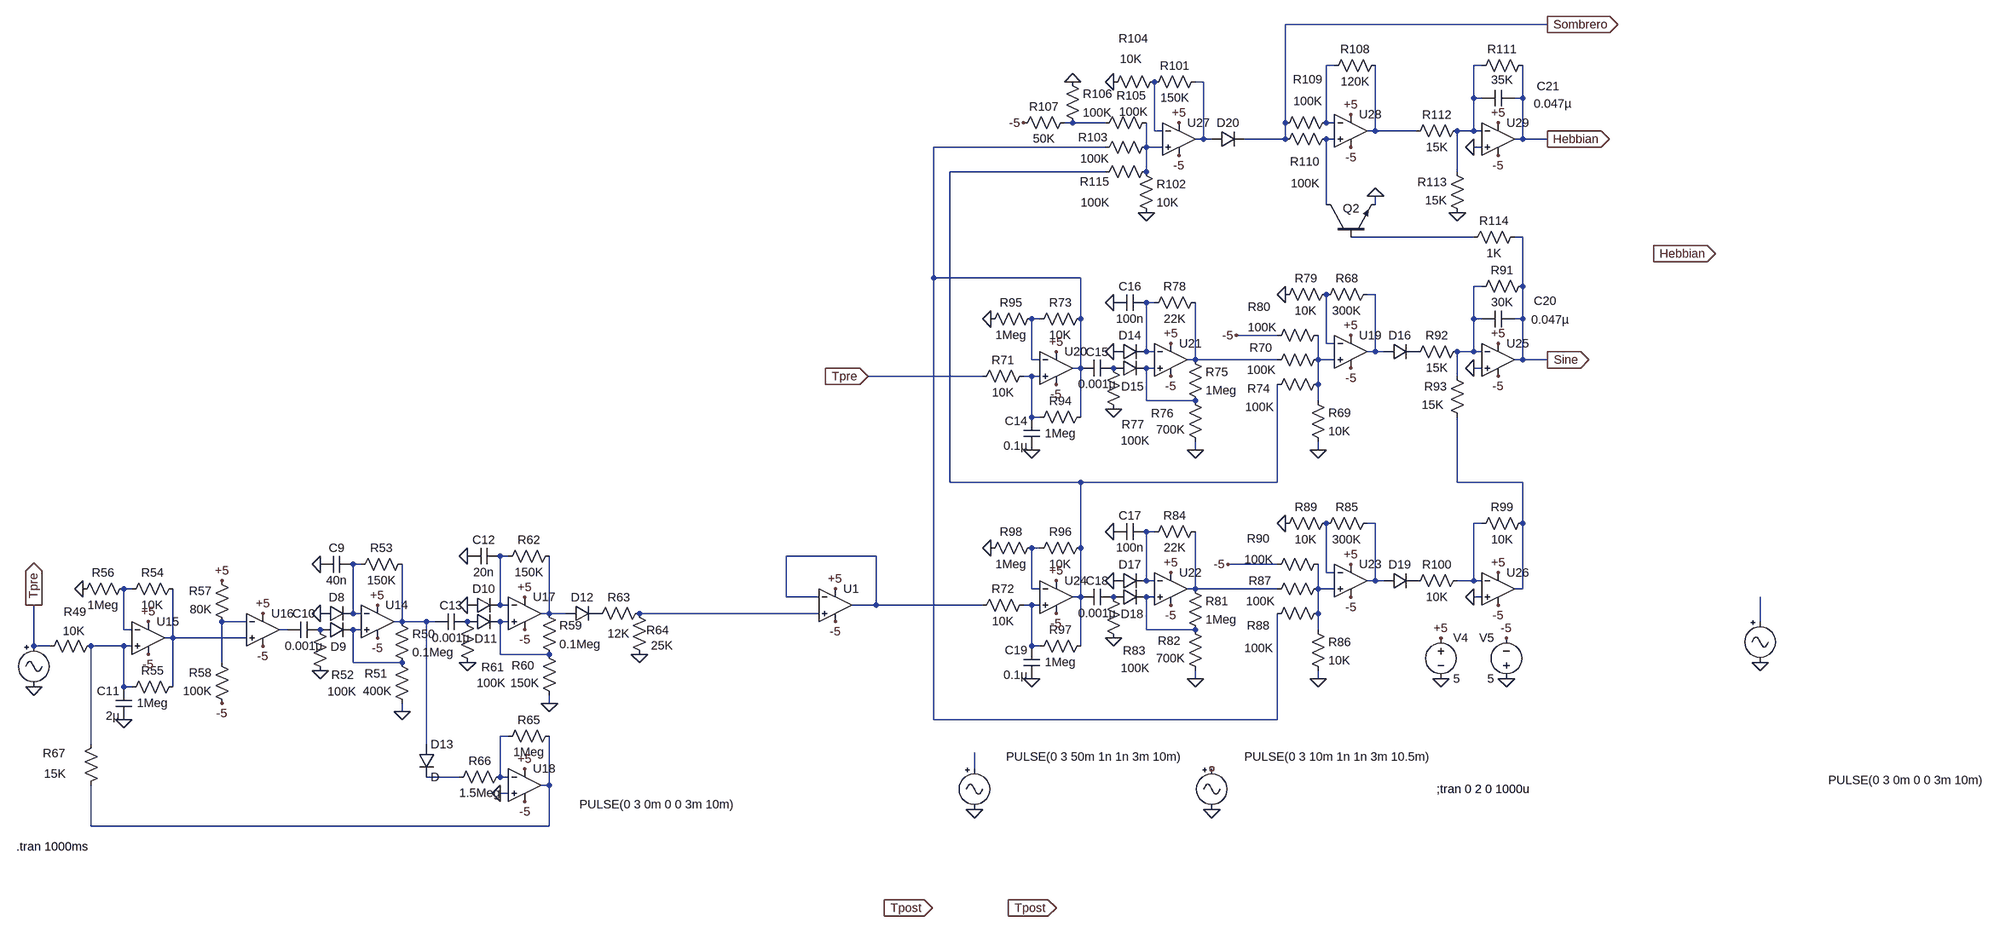
[diagram p0: schematic integrated_FB_leakage.asc]
integrated_FB_leakage.asc, the LTspice schematic file:
Version 4
SHEET 1 4420 1148
WIRE 2544 -704 2032 -704
WIRE 2128 -624 2112 -624
WIRE 2416 -624 2400 -624
WIRE 1872 -592 1856 -592
WIRE 2400 -560 2400 -624
WIRE 2416 -560 2400 -560
WIRE 2496 -560 2496 -624
WIRE 2496 -560 2480 -560
WIRE 1616 -512 1600 -512
WIRE 1680 -512 1616 -512
WIRE 2032 -512 2032 -704
WIRE 2112 -512 2112 -624
WIRE 2128 -512 2112 -512
WIRE 1776 -496 1776 -592
WIRE 1792 -496 1776 -496
WIRE 2208 -496 2208 -624
WIRE 2208 -496 2192 -496
WIRE 2288 -496 2208 -496
WIRE 2400 -496 2400 -560
WIRE 2400 -496 2368 -496
WIRE 2416 -496 2400 -496
WIRE 1872 -480 1872 -592
WIRE 1872 -480 1856 -480
WIRE 1888 -480 1872 -480
WIRE 2032 -480 2032 -512
WIRE 2032 -480 1952 -480
WIRE 2128 -480 2112 -480
WIRE 2496 -480 2496 -560
WIRE 2496 -480 2480 -480
WIRE 2544 -480 2496 -480
WIRE 1680 -464 1344 -464
WIRE 1760 -464 1760 -512
WIRE 1792 -464 1760 -464
WIRE 2416 -464 2400 -464
WIRE 1680 -416 1376 -416
WIRE 1760 -416 1760 -464
WIRE 2368 -416 2368 -496
WIRE 2112 -352 2112 -480
WIRE 2208 -352 2208 -368
WIRE 2400 -288 2160 -288
WIRE 2496 -288 2480 -288
WIRE 1344 -208 1344 -464
WIRE 1632 -208 1344 -208
WIRE 2416 -192 2400 -192
WIRE 2496 -192 2496 -288
WIRE 2208 -176 2192 -176
WIRE 1776 -160 1760 -160
WIRE 1552 -128 1536 -128
WIRE 1632 -128 1632 -208
WIRE 2400 -128 2400 -192
WIRE 2416 -128 2400 -128
WIRE 2496 -128 2496 -192
WIRE 2496 -128 2480 -128
WIRE 2016 -96 1936 -96
WIRE 2112 -80 2112 -176
WIRE 2128 -80 2112 -80
WIRE 1760 -64 1760 -160
WIRE 1776 -64 1760 -64
WIRE 2208 -64 2208 -176
WIRE 2208 -64 2192 -64
WIRE 2224 -64 2208 -64
WIRE 2400 -64 2400 -128
WIRE 2400 -64 2368 -64
WIRE 2416 -64 2400 -64
WIRE 1536 -48 1536 -128
WIRE 1552 -48 1536 -48
WIRE 1856 -48 1856 -160
WIRE 1856 -48 1840 -48
WIRE 2016 -48 1856 -48
WIRE 2096 -48 2096 -96
WIRE 2128 -48 2096 -48
WIRE 2496 -48 2496 -128
WIRE 2496 -48 2480 -48
WIRE 2544 -48 2496 -48
WIRE 1632 -32 1632 -128
WIRE 1632 -32 1616 -32
WIRE 1776 -32 1760 -32
WIRE 2416 -32 2400 -32
WIRE 1440 -16 1216 -16
WIRE 1536 -16 1520 -16
WIRE 1552 -16 1536 -16
WIRE 2368 -16 2368 -64
WIRE 2096 0 2096 -48
WIRE 1760 32 1760 -32
WIRE 1856 32 1760 32
WIRE 2096 32 2096 0
WIRE 1536 64 1536 -16
WIRE 1552 64 1536 64
WIRE 1632 64 1632 -32
WIRE 1856 128 1856 112
WIRE 2096 128 2096 112
WIRE 1376 192 1376 -416
WIRE 1632 192 1376 192
WIRE 2016 192 2016 0
WIRE 2016 192 1632 192
WIRE 2368 192 2368 64
WIRE 2496 192 2368 192
WIRE 2208 272 2192 272
WIRE 2416 272 2400 272
WIRE 2496 272 2496 192
WIRE 1776 288 1760 288
WIRE 1552 320 1536 320
WIRE 1632 320 1632 192
WIRE 448 336 432 336
WIRE 1232 336 1056 336
WIRE 160 352 144 352
WIRE 2016 352 1920 352
WIRE 2112 368 2112 272
WIRE 2128 368 2112 368
WIRE 1760 384 1760 288
WIRE 1776 384 1760 384
WIRE 2208 384 2208 272
WIRE 2208 384 2192 384
WIRE 2224 384 2208 384
WIRE 2400 384 2400 272
WIRE 2400 384 2368 384
WIRE 2416 384 2400 384
WIRE -288 400 -304 400
WIRE 1536 400 1536 320
WIRE 1552 400 1536 400
WIRE 1856 400 1856 288
WIRE 1856 400 1840 400
WIRE 2016 400 1856 400
WIRE 2096 400 2096 352
WIRE 2128 400 2096 400
WIRE 2496 400 2496 272
WIRE 2496 400 2480 400
WIRE 1056 416 1056 336
WIRE 1120 416 1056 416
WIRE 1632 416 1632 320
WIRE 1632 416 1616 416
WIRE 1776 416 1760 416
WIRE 2416 416 2400 416
WIRE 432 432 432 336
WIRE 448 432 432 432
WIRE 1232 432 1232 336
WIRE 1232 432 1184 432
WIRE 1440 432 1232 432
WIRE 1536 432 1520 432
WIRE 1552 432 1536 432
WIRE 144 448 144 352
WIRE 160 448 144 448
WIRE 528 448 528 336
WIRE 528 448 512 448
WIRE 560 448 528 448
WIRE 1120 448 704 448
WIRE 2096 448 2096 400
WIRE -64 464 -112 464
WIRE 240 464 240 352
WIRE 240 464 224 464
WIRE 288 464 240 464
WIRE 304 464 288 464
WIRE 448 464 432 464
WIRE 2960 464 2960 416
WIRE -304 480 -304 400
WIRE -288 480 -304 480
WIRE 16 480 0 480
WIRE 160 480 144 480
WIRE 1760 480 1760 416
WIRE 1856 480 1760 480
WIRE 2096 480 2096 448
WIRE -208 496 -208 400
WIRE -208 496 -224 496
WIRE -64 496 -208 496
WIRE -480 512 -480 432
WIRE -448 512 -480 512
WIRE -304 512 -368 512
WIRE -288 512 -304 512
WIRE 1536 512 1536 432
WIRE 1552 512 1536 512
WIRE 1632 512 1632 416
WIRE 432 528 432 464
WIRE 528 528 432 528
WIRE -112 544 -112 464
WIRE 144 544 144 480
WIRE 240 544 144 544
WIRE 1856 576 1856 560
WIRE 2096 576 2096 560
WIRE -304 592 -304 512
WIRE -288 592 -304 592
WIRE -208 592 -208 496
WIRE 528 624 528 608
WIRE 240 640 240 624
WIRE 1344 656 1344 -208
WIRE 2016 656 2016 448
WIRE 2016 656 1344 656
WIRE 448 688 432 688
WIRE -368 704 -368 512
WIRE 288 704 288 464
WIRE 1424 752 1424 720
WIRE 352 768 288 768
WIRE 432 768 432 688
WIRE 448 768 432 768
WIRE 528 784 528 688
WIRE 528 784 512 784
WIRE 448 800 432 800
WIRE -368 864 -368 784
WIRE 528 864 528 784
WIRE 528 864 -368 864
FLAG -480 592 0
FLAG 192 432 +5
FLAG 192 496 -5
FLAG 80 448 0
FLAG 80 352 0
FLAG 80 560 0
FLAG 240 640 0
FLAG -256 464 +5
FLAG -256 528 -5
FLAG -304 656 0
FLAG -384 400 0
FLAG -32 448 +5
FLAG -32 512 -5
FLAG -112 624 -5
FLAG -112 384 +5
FLAG 480 416 +5
FLAG 480 480 -5
FLAG 368 432 0
FLAG 368 336 0
FLAG 368 544 0
FLAG 528 624 0
FLAG 704 528 0
FLAG 480 752 +5
FLAG 480 816 -5
FLAG 432 800 0
FLAG 2160 -96 +5
FLAG 2160 -32 -5
FLAG 1888 832 0
FLAG 1424 832 0
FLAG 1584 -64 +5
FLAG 1584 0 -5
FLAG 1808 -80 +5
FLAG 1808 -16 -5
FLAG 1696 -64 0
FLAG 1696 -160 0
FLAG 1696 48 0
FLAG 2032 -176 0
FLAG 1936 -96 -5
FLAG 1808 368 +5
FLAG 1808 432 -5
FLAG 1696 384 0
FLAG 1696 288 0
FLAG 1696 496 0
FLAG 1856 576 0
FLAG 1856 128 0
FLAG 2160 352 +5
FLAG 2160 416 -5
FLAG 2032 272 0
FLAG 1920 352 -5
FLAG 1536 128 0
FLAG 1456 -128 0
FLAG 1584 384 +5
FLAG 1584 448 -5
FLAG 1536 576 0
FLAG 1456 320 0
FLAG 2448 -80 +5
FLAG 2448 -16 -5
FLAG 2448 368 +5
FLAG 2448 432 -5
FLAG 2400 416 0
FLAG 2400 -32 0
FLAG 2096 128 0
FLAG 2096 576 0
FLAG 2544 -48 Sine
IOPIN 2544 -48 Out
FLAG 1824 -512 +5
FLAG 1824 -448 -5
FLAG 1696 -592 0
FLAG 1616 -592 0
FLAG 2160 -528 +5
FLAG 2160 -464 -5
FLAG 1520 -512 -5
FLAG 2448 -512 +5
FLAG 2448 -448 -5
FLAG 2400 -464 0
FLAG 2368 -336 0
FLAG 2208 -368 0
FLAG 2544 -480 Hebbian
IOPIN 2544 -480 Out
FLAG 2544 -704 Sombrero
IOPIN 2544 -704 Out
FLAG 2336 576 0
FLAG 2464 576 0
FLAG 2464 496 -5
FLAG 2336 496 +5
FLAG 1584 1024 Tpost
IOPIN 1584 1024 In
FLAG 1248 1024 Tpost
IOPIN 1248 1024 Out
FLAG 1216 -16 Tpre
IOPIN 1216 -16 In
FLAG -480 432 Tpre
IOPIN -480 432 Out
FLAG 1760 -336 0
FLAG 2752 -256 Hebbian
IOPIN 2752 -256 Out
FLAG 1152 400 +5
FLAG 1152 464 -5
FLAG 2960 544 0
SYMBOL res -352 496 R90
WINDOW 0 -35 47 VBottom 2
WINDOW 3 -29 50 VTop 2
SYMATTR InstName R49
SYMATTR Value 10K
SYMBOL Opamps\\UniversalOpamp2 192 464 R0
SYMATTR InstName U14
SYMBOL diode 80 464 R270
WINDOW 0 32 32 VTop 2
WINDOW 3 0 32 Invisible 2
SYMATTR InstName D8
SYMBOL diode 80 496 R270
WINDOW 0 -33 36 VTop 2
WINDOW 3 0 32 Invisible 2
SYMATTR InstName D9
SYMBOL res 224 448 R0
SYMATTR InstName R50
SYMATTR Value 0.1Meg
SYMBOL res 256 640 R180
WINDOW 0 45 74 Left 2
WINDOW 3 36 40 Left 2
SYMATTR InstName R51
SYMATTR Value 400K
SYMBOL res 64 464 R0
WINDOW 0 38 104 Left 2
WINDOW 3 30 137 Left 2
SYMATTR InstName R52
SYMATTR Value 100K
SYMBOL res 256 336 R90
WINDOW 0 0 56 VBottom 2
WINDOW 3 32 56 VTop 2
SYMATTR InstName R53
SYMATTR Value 150K
SYMBOL cap 144 336 R90
WINDOW 0 0 32 VBottom 2
WINDOW 3 32 32 VTop 2
SYMATTR InstName C9
SYMATTR Value 40n
SYMBOL cap 80 464 R90
WINDOW 0 0 32 VBottom 2
WINDOW 3 32 32 VTop 2
SYMATTR InstName C10
SYMATTR Value 0.001µ
SYMBOL Opamps\\UniversalOpamp2 -256 496 R0
SYMATTR InstName U15
SYMBOL cap -288 656 R180
WINDOW 0 24 56 Left 2
WINDOW 3 24 8 Left 2
SYMATTR InstName C11
SYMATTR Value 2µ
SYMBOL res -192 384 R90
WINDOW 0 0 56 VBottom 2
WINDOW 3 32 56 VTop 2
SYMATTR InstName R54
SYMATTR Value 10K
SYMBOL res -192 576 R90
WINDOW 0 0 56 VBottom 2
WINDOW 3 32 56 VTop 2
SYMATTR InstName R55
SYMATTR Value 1Meg
SYMBOL res -400 416 R270
WINDOW 0 32 56 VTop 2
WINDOW 3 0 56 VBottom 2
SYMATTR InstName R56
SYMATTR Value 1Meg
SYMBOL Misc\\signal -480 496 R0
WINDOW 0 24 16 Invisible 2
WINDOW 3 1067 326 Left 2
WINDOW 123 0 0 Left 2
WINDOW 39 0 0 Left 2
SYMATTR InstName V7
SYMATTR Value PULSE(0 3 0m 0 0 3m 10m)
SYMBOL Opamps\\UniversalOpamp2 -32 480 R0
SYMATTR InstName U16
SYMBOL res -96 480 R180
WINDOW 0 36 76 Left 2
WINDOW 3 36 40 Left 2
SYMATTR InstName R57
SYMATTR Value 80K
SYMBOL res -96 640 R180
WINDOW 0 36 76 Left 2
WINDOW 3 36 40 Left 2
SYMATTR InstName R58
SYMATTR Value 100K
SYMBOL Opamps\\UniversalOpamp2 480 448 R0
SYMATTR InstName U17
SYMBOL diode 368 448 R270
WINDOW 0 32 32 VTop 2
WINDOW 3 0 32 Invisible 2
SYMATTR InstName D10
SYMBOL diode 368 480 R270
WINDOW 0 -33 36 VTop 2
WINDOW 3 0 32 Invisible 2
SYMATTR InstName D11
SYMBOL res 512 432 R0
SYMATTR InstName R59
SYMATTR Value 0.1Meg
SYMBOL res 544 624 R180
WINDOW 0 45 74 Left 2
WINDOW 3 36 40 Left 2
SYMATTR InstName R60
SYMATTR Value 150K
SYMBOL res 352 448 R0
WINDOW 0 43 105 Left 2
WINDOW 3 34 136 Left 2
SYMATTR InstName R61
SYMATTR Value 100K
SYMBOL res 544 320 R90
WINDOW 0 0 56 VBottom 2
WINDOW 3 32 56 VTop 2
SYMATTR InstName R62
SYMATTR Value 150K
SYMBOL cap 432 320 R90
WINDOW 0 0 32 VBottom 2
WINDOW 3 32 32 VTop 2
SYMATTR InstName C12
SYMATTR Value 20n
SYMBOL cap 368 448 R90
WINDOW 0 0 32 VBottom 2
WINDOW 3 32 32 VTop 2
SYMATTR InstName C13
SYMATTR Value 0.001µ
SYMBOL diode 560 464 R270
WINDOW 0 32 32 VTop 2
WINDOW 3 0 32 Invisible 2
SYMATTR InstName D12
SYMBOL res 720 432 R90
WINDOW 0 0 56 VBottom 2
WINDOW 3 40 57 VTop 2
SYMATTR InstName R63
SYMATTR Value 12K
SYMBOL res 720 544 R180
WINDOW 0 -42 63 Left 2
WINDOW 3 -50 33 Left 2
SYMATTR InstName R64
SYMATTR Value 25K
SYMBOL Opamps\\UniversalOpamp2 480 784 R0
SYMATTR InstName U18
SYMBOL res 544 672 R90
WINDOW 0 0 56 VBottom 2
WINDOW 3 32 56 VTop 2
SYMATTR InstName R65
SYMATTR Value 1Meg
SYMBOL res 336 784 R270
WINDOW 0 32 56 VTop 2
WINDOW 3 0 56 VBottom 2
SYMATTR InstName R66
SYMATTR Value 1.5Meg
SYMBOL diode 272 704 R0
SYMATTR InstName D13
SYMBOL res -352 688 M0
WINDOW 0 66 34 Left 2
WINDOW 3 65 74 Left 2
SYMATTR InstName R67
SYMATTR Value 15K
SYMBOL Opamps\\UniversalOpamp2 2160 -64 R0
SYMATTR InstName U19
SYMBOL res 2208 -192 R90
WINDOW 0 0 56 VBottom 2
WINDOW 3 32 56 VTop 2
SYMATTR InstName R68
SYMATTR Value 300K
SYMBOL res 2080 16 R0
SYMATTR InstName R69
SYMATTR Value 10K
SYMBOL res 2112 -64 R90
WINDOW 0 8 128 VBottom 2
WINDOW 3 20 127 VTop 2
SYMATTR InstName R70
SYMATTR Value 100K
SYMBOL Opamps\\UniversalOpamp2 1584 -32 R0
SYMATTR InstName U20
SYMBOL cap 1552 128 R180
WINDOW 0 24 56 Left 2
WINDOW 3 24 8 Left 2
SYMATTR InstName C14
SYMATTR Value 0.1µ
SYMBOL res 1536 -32 R90
WINDOW 0 0 56 VBottom 2
WINDOW 3 32 56 VTop 2
SYMATTR InstName R71
SYMATTR Value 10K
SYMBOL res 1536 416 R90
WINDOW 0 0 56 VBottom 2
WINDOW 3 32 56 VTop 2
SYMATTR InstName R72
SYMATTR Value 10K
SYMBOL res 1648 -144 R90
WINDOW 0 0 56 VBottom 2
WINDOW 3 32 56 VTop 2
SYMATTR InstName R73
SYMATTR Value 10K
SYMBOL res 2112 -16 R90
WINDOW 0 40 132 VBottom 2
WINDOW 3 45 130 VTop 2
SYMATTR InstName R74
SYMATTR Value 100K
SYMBOL Opamps\\UniversalOpamp2 1808 -48 R0
SYMATTR InstName U21
SYMBOL diode 1696 -48 R270
WINDOW 0 32 32 VTop 2
WINDOW 3 0 32 Invisible 2
SYMATTR InstName D14
SYMBOL diode 1696 -16 R270
WINDOW 0 -36 37 VTop 2
WINDOW 3 0 32 Invisible 2
SYMATTR InstName D15
SYMBOL res 1840 -64 R0
SYMATTR InstName R75
SYMATTR Value 1Meg
SYMBOL res 1872 128 R180
WINDOW 0 58 71 Left 2
WINDOW 3 36 40 Left 2
SYMATTR InstName R76
SYMATTR Value 700K
SYMBOL res 1680 -48 R0
WINDOW 0 32 126 Left 2
WINDOW 3 30 158 Left 2
SYMATTR InstName R77
SYMATTR Value 100K
SYMBOL cap 1696 -48 R90
WINDOW 0 0 32 VBottom 2
WINDOW 3 32 32 VTop 2
SYMATTR InstName C15
SYMATTR Value 0.001µ
SYMBOL res 1872 -176 R90
WINDOW 0 0 56 VBottom 2
WINDOW 3 32 56 VTop 2
SYMATTR InstName R78
SYMATTR Value 22K
SYMBOL cap 1760 -176 R90
WINDOW 0 0 32 VBottom 2
WINDOW 3 32 32 VTop 2
SYMATTR InstName C16
SYMATTR Value 100n
SYMBOL res 2016 -160 R270
WINDOW 0 32 56 VTop 2
WINDOW 3 0 56 VBottom 2
SYMATTR InstName R79
SYMATTR Value 10K
SYMBOL diode 2224 -48 R270
WINDOW 0 32 32 VTop 2
WINDOW 3 0 32 Invisible 2
SYMATTR InstName D16
SYMBOL res 2112 -112 R90
WINDOW 0 -24 131 VBottom 2
WINDOW 3 -15 125 VTop 2
SYMATTR InstName R80
SYMATTR Value 100K
SYMBOL Opamps\\UniversalOpamp2 1808 400 R0
SYMATTR InstName U22
SYMBOL diode 1696 400 R270
WINDOW 0 32 32 VTop 2
WINDOW 3 0 32 Invisible 2
SYMATTR InstName D17
SYMBOL diode 1696 432 R270
WINDOW 0 -33 36 VTop 2
WINDOW 3 0 32 Invisible 2
SYMATTR InstName D18
SYMBOL res 1840 384 R0
SYMATTR InstName R81
SYMATTR Value 1Meg
SYMBOL res 1872 576 R180
WINDOW 0 45 74 Left 2
WINDOW 3 36 40 Left 2
SYMATTR InstName R82
SYMATTR Value 700K
SYMBOL res 1680 400 R0
WINDOW 0 34 121 Left 2
WINDOW 3 30 155 Left 2
SYMATTR InstName R83
SYMATTR Value 100K
SYMBOL res 1872 272 R90
WINDOW 0 0 56 VBottom 2
WINDOW 3 32 56 VTop 2
SYMATTR InstName R84
SYMATTR Value 22K
SYMBOL cap 1760 272 R90
WINDOW 0 0 32 VBottom 2
WINDOW 3 32 32 VTop 2
SYMATTR InstName C17
SYMATTR Value 100n
SYMBOL cap 1696 400 R90
WINDOW 0 0 32 VBottom 2
WINDOW 3 32 32 VTop 2
SYMATTR InstName C18
SYMATTR Value 0.001µ
SYMBOL Opamps\\UniversalOpamp2 2160 384 R0
SYMATTR InstName U23
SYMBOL res 2208 256 R90
WINDOW 0 0 56 VBottom 2
WINDOW 3 32 56 VTop 2
SYMATTR InstName R85
SYMATTR Value 300K
SYMBOL res 2080 464 R0
SYMATTR InstName R86
SYMATTR Value 10K
SYMBOL res 2112 384 R90
WINDOW 0 16 130 VBottom 2
WINDOW 3 25 129 VTop 2
SYMATTR InstName R87
SYMATTR Value 100K
SYMBOL res 2112 432 R90
WINDOW 0 55 133 VBottom 2
WINDOW 3 68 132 VTop 2
SYMATTR InstName R88
SYMATTR Value 100K
SYMBOL res 2016 288 R270
WINDOW 0 32 56 VTop 2
WINDOW 3 0 56 VBottom 2
SYMATTR InstName R89
SYMATTR Value 10K
SYMBOL diode 2224 400 R270
WINDOW 0 32 32 VTop 2
WINDOW 3 0 32 Invisible 2
SYMATTR InstName D19
SYMBOL res 2112 336 R90
WINDOW 0 -19 133 VBottom 2
WINDOW 3 -9 132 VTop 2
SYMATTR InstName R90
SYMATTR Value 100K
SYMBOL res 2512 -208 R90
WINDOW 0 0 56 VBottom 2
WINDOW 3 32 56 VTop 2
SYMATTR InstName R91
SYMATTR Value 30K
SYMBOL res 2384 -80 R90
WINDOW 0 0 56 VBottom 2
WINDOW 3 32 56 VTop 2
SYMATTR InstName R92
SYMATTR Value 15K
SYMBOL res 2384 80 R180
WINDOW 0 36 76 Left 2
WINDOW 3 43 40 Left 2
SYMATTR InstName R93
SYMATTR Value 15K
SYMBOL res 1648 48 R90
WINDOW 0 0 56 VBottom 2
WINDOW 3 32 56 VTop 2
SYMATTR InstName R94
SYMATTR Value 1Meg
SYMBOL res 1552 -144 R90
WINDOW 0 0 56 VBottom 2
WINDOW 3 32 56 VTop 2
SYMATTR InstName R95
SYMATTR Value 1Meg
SYMBOL Opamps\\UniversalOpamp2 1584 416 R0
SYMATTR InstName U24
SYMBOL cap 1552 576 R180
WINDOW 0 24 56 Left 2
WINDOW 3 24 8 Left 2
SYMATTR InstName C19
SYMATTR Value 0.1µ
SYMBOL res 1648 304 R90
WINDOW 0 0 56 VBottom 2
WINDOW 3 32 56 VTop 2
SYMATTR InstName R96
SYMATTR Value 10K
SYMBOL res 1648 496 R90
WINDOW 0 0 56 VBottom 2
WINDOW 3 32 56 VTop 2
SYMATTR InstName R97
SYMATTR Value 1Meg
SYMBOL res 1552 304 R90
WINDOW 0 0 56 VBottom 2
WINDOW 3 32 56 VTop 2
SYMATTR InstName R98
SYMATTR Value 1Meg
SYMBOL Opamps\\UniversalOpamp2 2448 -48 R0
SYMATTR InstName U25
SYMBOL res 2512 256 R90
WINDOW 0 0 56 VBottom 2
WINDOW 3 32 56 VTop 2
SYMATTR InstName R99
SYMATTR Value 10K
SYMBOL Opamps\\UniversalOpamp2 2448 400 R0
SYMATTR InstName U26
SYMBOL res 2384 368 R90
WINDOW 0 0 56 VBottom 2
WINDOW 3 32 56 VTop 2
SYMATTR InstName R100
SYMATTR Value 10K
SYMBOL cap 2480 -144 R90
WINDOW 0 -4 -60 VBottom 2
WINDOW 3 2 -70 VTop 2
SYMATTR InstName C20
SYMATTR Value 0.047µ
SYMBOL Opamps\\UniversalOpamp2 1824 -480 R0
SYMATTR InstName U27
SYMBOL res 1872 -608 R90
WINDOW 0 0 56 VBottom 2
WINDOW 3 32 56 VTop 2
SYMATTR InstName R101
SYMATTR Value 150K
SYMBOL res 1744 -432 R0
SYMATTR InstName R102
SYMATTR Value 10K
SYMBOL res 1776 -480 R90
WINDOW 0 12 120 VBottom 2
WINDOW 3 23 117 VTop 2
SYMATTR InstName R103
SYMATTR Value 100K
SYMBOL res 1680 -576 R270
WINDOW 0 85 55 VTop 2
WINDOW 3 76 50 VBottom 2
SYMATTR InstName R104
SYMATTR Value 10K
SYMBOL res 1776 -528 R90
WINDOW 0 -21 45 VBottom 2
WINDOW 3 -21 41 VTop 2
SYMATTR InstName R105
SYMATTR Value 100K
SYMBOL res 1600 -608 R0
SYMATTR InstName R106
SYMATTR Value 100K
SYMBOL res 1616 -528 R90
WINDOW 0 0 56 VBottom 2
WINDOW 3 32 56 VTop 2
SYMATTR InstName R107
SYMATTR Value 50K
SYMBOL diode 1888 -464 R270
WINDOW 0 32 32 VTop 2
WINDOW 3 0 32 Invisible 2
SYMATTR InstName D20
SYMBOL res 2224 -640 R90
WINDOW 0 0 56 VBottom 2
WINDOW 3 32 56 VTop 2
SYMATTR InstName R108
SYMATTR Value 120K
SYMBOL Opamps\\UniversalOpamp2 2160 -496 R0
SYMATTR InstName U28
SYMBOL res 2128 -528 R90
WINDOW 0 -53 52 VBottom 2
WINDOW 3 -42 52 VTop 2
SYMATTR InstName R109
SYMATTR Value 100K
SYMBOL res 2128 -496 R90
WINDOW 0 76 58 VBottom 2
WINDOW 3 87 57 VTop 2
SYMATTR InstName R110
SYMATTR Value 100K
SYMBOL npn 2112 -288 R270
WINDOW 0 56 32 VRight 2
WINDOW 3 56 68 Invisible 2
SYMATTR InstName Q2
SYMBOL res 2512 -640 R90
WINDOW 0 0 56 VBottom 2
WINDOW 3 60 56 VBottom 2
SYMATTR InstName R111
SYMATTR Value 35K
SYMBOL res 2384 -512 R90
WINDOW 0 0 56 VBottom 2
WINDOW 3 32 56 VTop 2
SYMATTR InstName R112
SYMATTR Value 15K
SYMBOL res 2384 -320 R180
WINDOW 0 36 76 Left 2
WINDOW 3 36 40 Left 2
SYMATTR InstName R113
SYMATTR Value 15K
SYMBOL Opamps\\UniversalOpamp2 2448 -480 R0
SYMATTR InstName U29
SYMBOL cap 2480 -576 R90
WINDOW 0 8 -66 VBottom 2
WINDOW 3 11 -75 VTop 2
SYMATTR InstName C21
SYMATTR Value 0.047µ
SYMBOL res 2384 -272 R270
WINDOW 0 32 56 VTop 2
WINDOW 3 0 56 VBottom 2
SYMATTR InstName R114
SYMATTR Value 1K
SYMBOL voltage 2336 480 R0
WINDOW 123 0 0 Left 2
WINDOW 39 0 0 Left 2
SYMATTR InstName V4
SYMATTR Value 5
SYMBOL voltage 2464 592 R180
WINDOW 0 24 96 Left 2
WINDOW 3 24 16 Left 2
WINDOW 123 0 0 Left 2
WINDOW 39 0 0 Left 2
SYMATTR InstName V5
SYMATTR Value 5
SYMBOL Misc\\signal 1424 736 R0
WINDOW 0 24 16 Invisible 2
WINDOW 3 62 -8 Left 2
WINDOW 123 0 0 Left 2
WINDOW 39 0 0 Left 2
SYMATTR InstName V6
SYMATTR Value PULSE(0 3 50m 1n 1n 3m 10m)
SYMBOL Misc\\signal 1888 736 R0
WINDOW 0 24 16 Invisible 2
WINDOW 3 64 -8 Left 2
WINDOW 123 0 0 Left 2
WINDOW 39 0 0 Left 2
SYMATTR InstName V8
SYMATTR Value PULSE(0 3 10m 1n 1n 3m 10.5m)
SYMBOL res 1776 -432 R90
WINDOW 0 51 117 VBottom 2
WINDOW 3 61 116 VTop 2
SYMATTR InstName R115
SYMATTR Value 100K
SYMBOL Opamps\\UniversalOpamp2 1152 432 R0
SYMATTR InstName U1
SYMBOL Misc\\signal 2960 448 R0
WINDOW 0 24 16 Invisible 2
WINDOW 3 1067 326 Left 2
WINDOW 123 0 0 Left 2
WINDOW 39 0 0 Left 2
SYMATTR InstName V1
SYMATTR Value PULSE(0 3 0m 0 0 3m 10m)
TEXT -514 904 Left 2 !.tran 1000ms
TEXT 2328 792 Left 2 !;tran 0 2 0 1000u

The netlist it stands for:
* integrated_FB_leakage.asc
R49 N044 Tpre 10K
XU14 N042 N028 +5 -5 N038 level.2 Avol=1Meg GBW=10Meg Slew=10Meg ilimit=25m rail=0 Vos=0 phimargin=45 en=0 enk=0 in=0 ink=0 Rin=500Meg  ; pins IN+ IN- V+ V- OUT
D8 0 N028 D
D9 P001 N042 D
R50 N038 N042 0.1Meg
R51 0 N042 400K
R52 P001 0 100K
R53 N038 N028 150K
C9 N028 0 40n
C10 P001 N041 0.001µ
XU15 N044 N030 +5 -5 N043 level.2 Avol=1Meg GBW=10Meg Slew=10Meg ilimit=25m rail=0 Vos=0 phimargin=45 en=0 enk=0 in=0 ink=0 Rin=500Meg  ; pins IN+ IN- V+ V- OUT
C11 0 N044 2µ
R54 N043 N030 10K
R55 N043 N044 1Meg
R56 0 N030 1Meg
V7 Tpre 0 PULSE(0 3 0m 0 0 3m 10m)
XU16 N043 N037 +5 -5 N041 level.2 Avol=1Meg GBW=10Meg Slew=10Meg ilimit=25m rail=0 Vos=0 phimargin=45 en=0 enk=0 in=0 ink=0 Rin=500Meg  ; pins IN+ IN- V+ V- OUT
R57 N037 +5 80K
R58 -5 N037 100K
XU17 N039 N026 +5 -5 N035 level.2 Avol=1Meg GBW=10Meg Slew=10Meg ilimit=25m rail=0 Vos=0 phimargin=45 en=0 enk=0 in=0 ink=0 Rin=500Meg  ; pins IN+ IN- V+ V- OUT
D10 0 N026 D
D11 P002 N039 D
R59 N035 N039 0.1Meg
R60 0 N039 150K
R61 P002 0 100K
R62 N035 N026 150K
C12 N026 0 20n
C13 P002 N038 0.001µ
D12 N035 P003 D
R63 N036 P003 12K
R64 0 N036 25K
XU18 0 N045 +5 -5 N048 level.2 Avol=1Meg GBW=10Meg Slew=10Meg ilimit=25m rail=0 Vos=0 phimargin=45 en=0 enk=0 in=0 ink=0 Rin=500Meg  ; pins IN+ IN- V+ V- OUT
R65 N048 N045 1Meg
R66 N047 N045 1.5Meg
D13 N038 N047 D
R67 N044 N048 15K
XU19 N018 N016 +5 -5 N013 level.2 Avol=1Meg GBW=10Meg Slew=10Meg ilimit=25m rail=0 Vos=0 phimargin=45 en=0 enk=0 in=0 ink=0 Rin=500Meg  ; pins IN+ IN- V+ V- OUT
R68 N013 N016 300K
R69 N018 0 10K
R70 N018 N017 100K
XU20 N020 N015 +5 -5 N008 level.2 Avol=1Meg GBW=10Meg Slew=10Meg ilimit=25m rail=0 Vos=0 phimargin=45 en=0 enk=0 in=0 ink=0 Rin=500Meg  ; pins IN+ IN- V+ V- OUT
C14 0 N020 0.1µ
R71 N020 Tpre 10K
R72 N034 N027 10K
R73 N008 N015 10K
R74 N018 N010 100K
XU21 N019 N014 +5 -5 N017 level.2 Avol=1Meg GBW=10Meg Slew=10Meg ilimit=25m rail=0 Vos=0 phimargin=45 en=0 enk=0 in=0 ink=0 Rin=500Meg  ; pins IN+ IN- V+ V- OUT
D14 0 N014 D
D15 P004 N019 D
R75 N017 N019 1Meg
R76 0 N019 700K
R77 P004 0 100K
C15 P004 N008 0.001µ
R78 N017 N014 22K
C16 N014 0 100n
R79 0 N016 10K
D16 N013 P005 D
R80 N018 -5 100K
XU22 N033 N024 +5 -5 N031 level.2 Avol=1Meg GBW=10Meg Slew=10Meg ilimit=25m rail=0 Vos=0 phimargin=45 en=0 enk=0 in=0 ink=0 Rin=500Meg  ; pins IN+ IN- V+ V- OUT
D17 0 N024 D
D18 P006 N033 D
R81 N031 N033 1Meg
R82 0 N033 700K
R83 P006 0 100K
R84 N031 N024 22K
C17 N024 0 100n
C18 P006 N010 0.001µ
XU23 N032 N029 +5 -5 N022 level.2 Avol=1Meg GBW=10Meg Slew=10Meg ilimit=25m rail=0 Vos=0 phimargin=45 en=0 enk=0 in=0 ink=0 Rin=500Meg  ; pins IN+ IN- V+ V- OUT
R85 N022 N029 300K
R86 N032 0 10K
R87 N032 N031 100K
R88 N032 N008 100K
R89 0 N029 10K
D19 N022 P007 D
R90 N032 -5 100K
R91 Sine N012 30K
R92 N012 P005 15K
R93 N021 N012 15K
R94 N008 N020 1Meg
R95 N015 0 1Meg
XU24 N034 N025 +5 -5 N010 level.2 Avol=1Meg GBW=10Meg Slew=10Meg ilimit=25m rail=0 Vos=0 phimargin=45 en=0 enk=0 in=0 ink=0 Rin=500Meg  ; pins IN+ IN- V+ V- OUT
C19 0 N034 0.1µ
R96 N010 N025 10K
R97 N010 N034 1Meg
R98 N025 0 1Meg
XU25 0 N012 +5 -5 Sine level.2 Avol=1Meg GBW=10Meg Slew=10Meg ilimit=25m rail=0 Vos=0 phimargin=45 en=0 enk=0 in=0 ink=0 Rin=500Meg  ; pins IN+ IN- V+ V- OUT
R99 N021 N023 10K
XU26 0 N023 +5 -5 N021 level.2 Avol=1Meg GBW=10Meg Slew=10Meg ilimit=25m rail=0 Vos=0 phimargin=45 en=0 enk=0 in=0 ink=0 Rin=500Meg  ; pins IN+ IN- V+ V- OUT
R100 N023 P007 10K
C20 Sine N012 0.047µ
XU27 N009 N005 +5 -5 N003 level.2 Avol=1Meg GBW=10Meg Slew=10Meg ilimit=25m rail=0 Vos=0 phimargin=45 en=0 enk=0 in=0 ink=0 Rin=500Meg  ; pins IN+ IN- V+ V- OUT
R101 N003 N005 150K
R102 N009 0 10K
R103 N009 N008 100K
R104 0 N005 10K
R105 N009 N004 100K
R106 0 N004 100K
R107 N004 -5 50K
D20 N003 Sombrero D
R108 N006 N001 120K
XU28 N007 N001 +5 -5 N006 level.2 Avol=1Meg GBW=10Meg Slew=10Meg ilimit=25m rail=0 Vos=0 phimargin=45 en=0 enk=0 in=0 ink=0 Rin=500Meg  ; pins IN+ IN- V+ V- OUT
R109 N001 Sombrero 100K
R110 N007 Sombrero 100K
Q2 N007 N011 0 0 NPN
R111 Hebbian N002 35K
R112 N002 N006 15K
R113 0 N002 15K
XU29 0 N002 +5 -5 Hebbian level.2 Avol=1Meg GBW=10Meg Slew=10Meg ilimit=25m rail=0 Vos=0 phimargin=45 en=0 enk=0 in=0 ink=0 Rin=500Meg  ; pins IN+ IN- V+ V- OUT
C21 Hebbian N002 0.047µ
R114 N011 Sine 1K
V4 +5 0 5
V5 0 -5 5
V6 N046 0 PULSE(0 3 50m 1n 1n 3m 10m)
V8 NC_01 0 PULSE(0 3 10m 1n 1n 3m 10.5m)
R115 N009 N010 100K
XU1 N036 N027 +5 -5 N027 level.2 Avol=1Meg GBW=10Meg Slew=10Meg ilimit=25m rail=0 Vos=0 phimargin=45 en=0 enk=0 in=0 ink=0 Rin=500Meg  ; pins IN+ IN- V+ V- OUT
V1 N040 0 PULSE(0 3 0m 0 0 3m 10m)
.model D D
.lib standard.dio
.model NPN NPN
.model PNP PNP
.lib standard.bjt
.tran 1000ms
;tran 0 2 0 1000u
.lib UniversalOpamps2.sub
.backanno
.end